# EasyEDA schematic SCH_BIKE-IOT-PCB-BY-AIM_2024-07-08.json
TITLE: charging station; REV: 1.0; Date: 2022-11-29; Sheet: 1/1; Drawn By: Humayun Siraj; Company: NCL-NEDUET
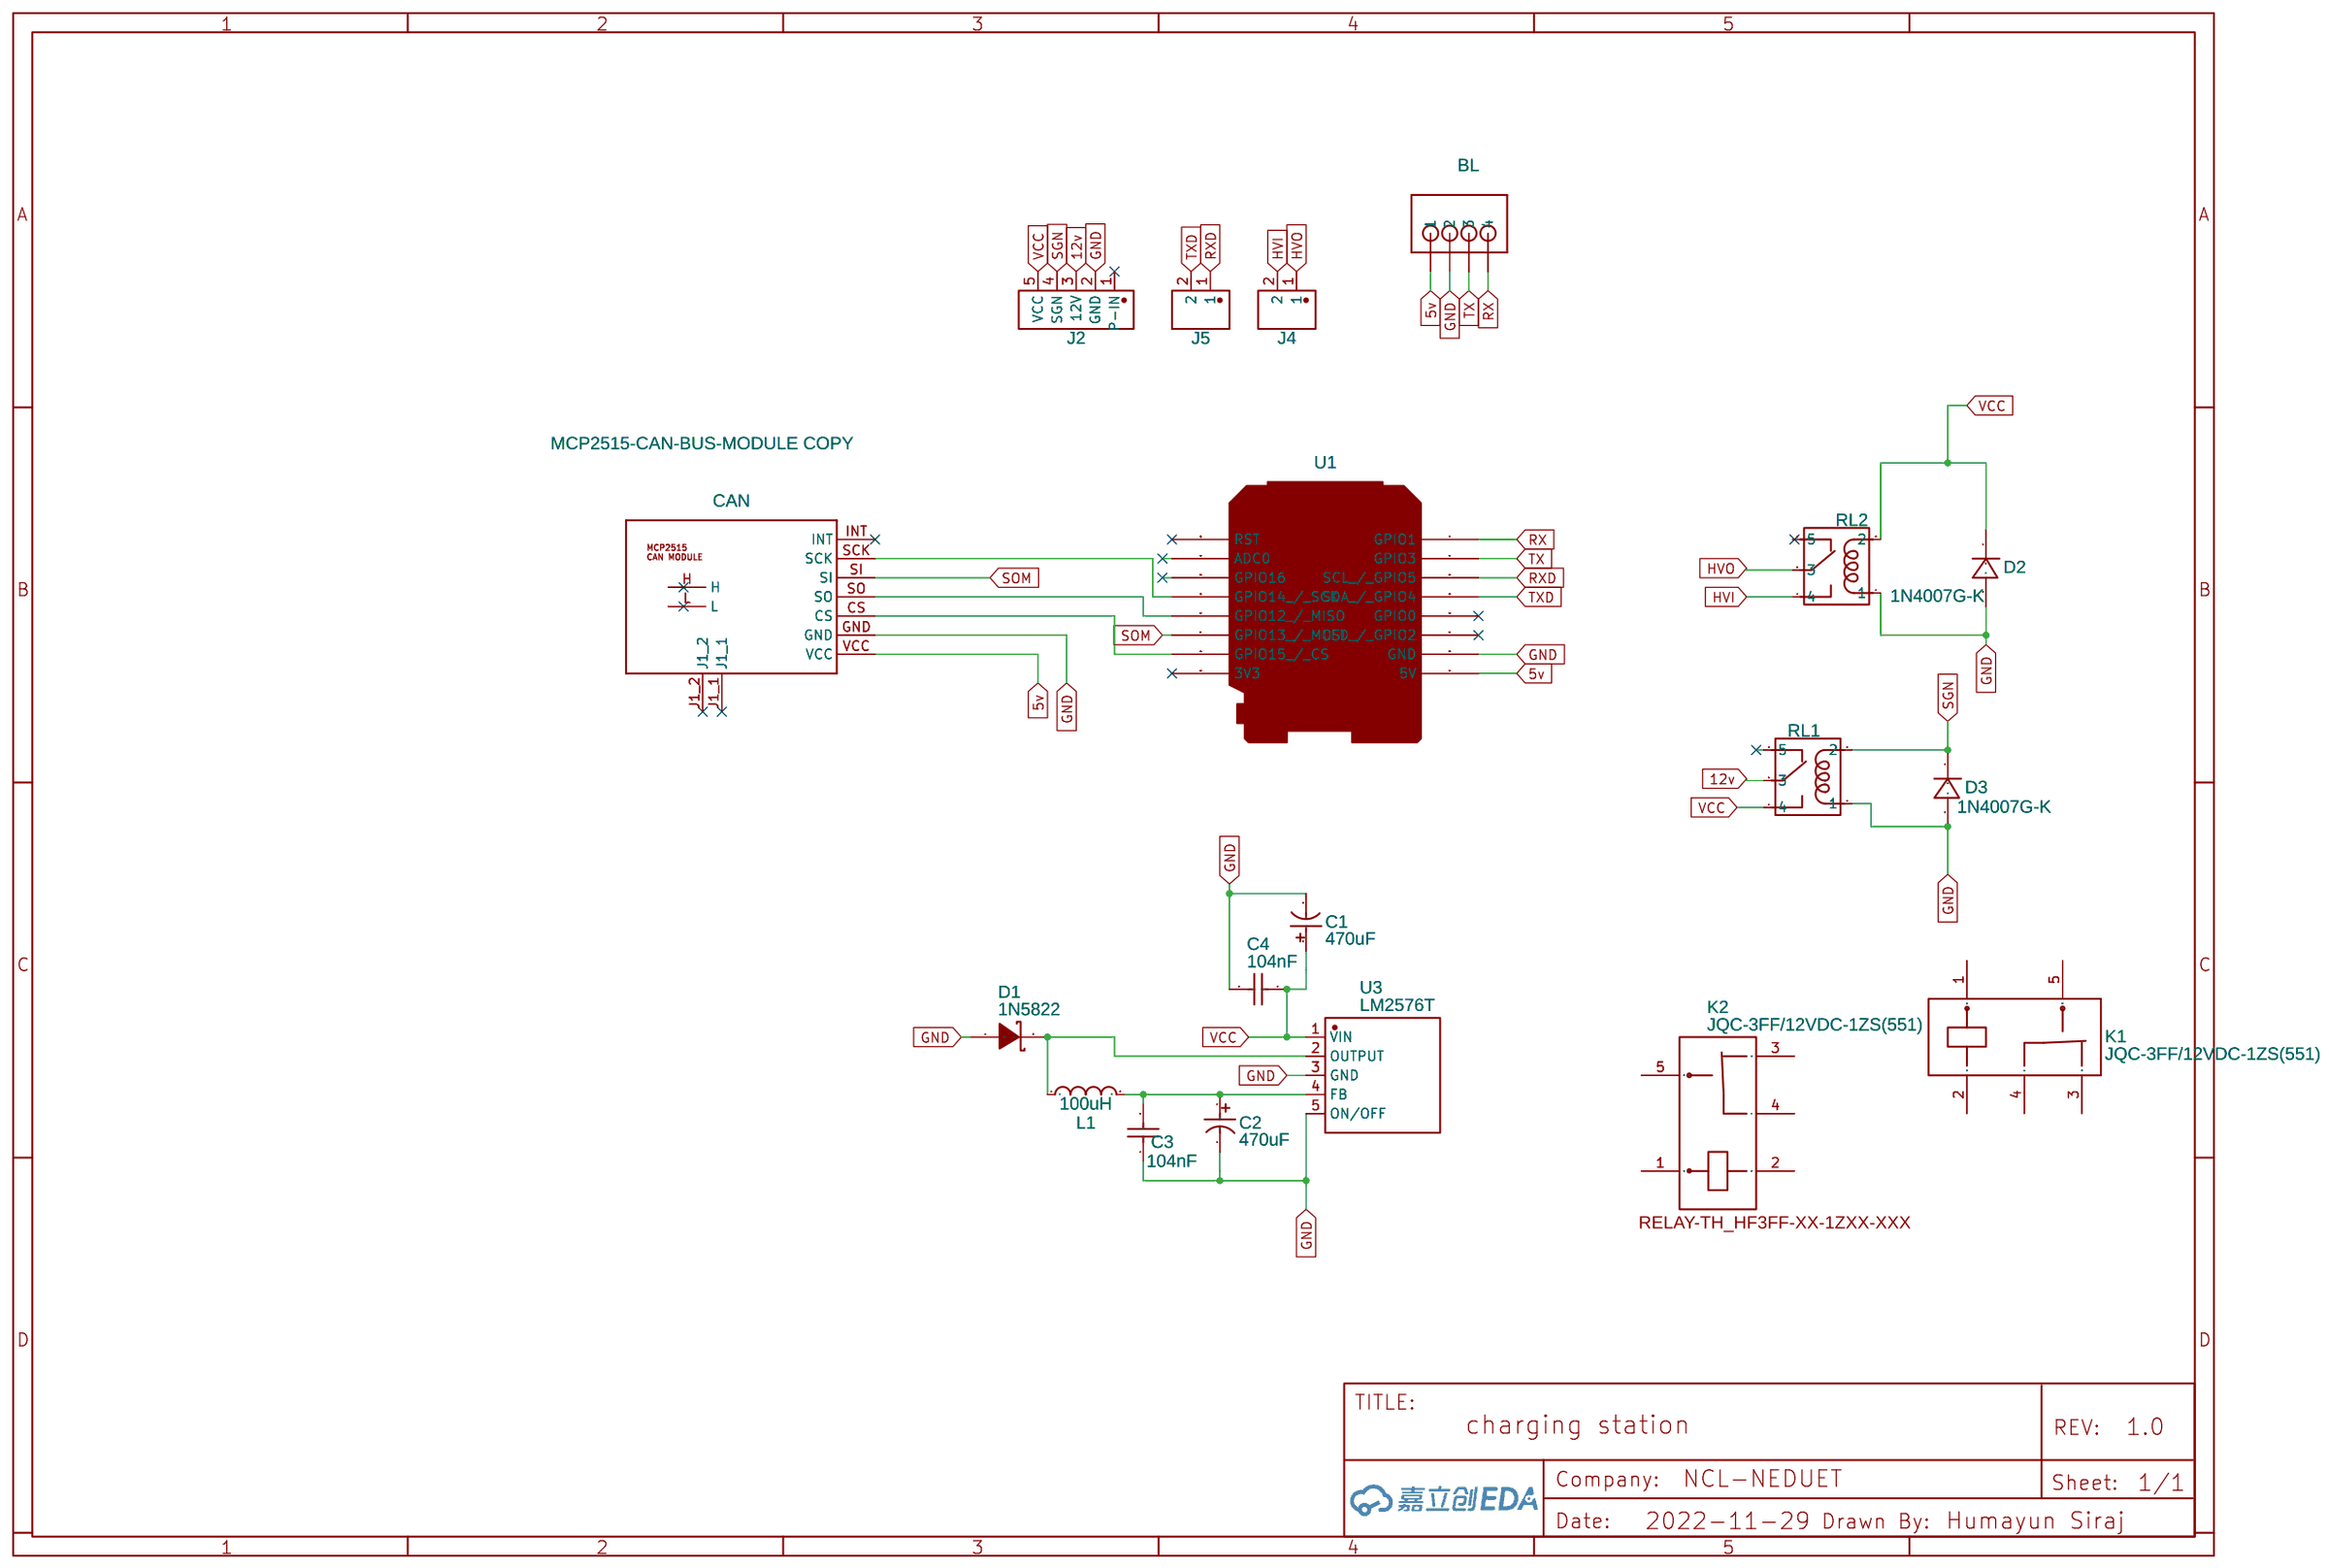
[diagram p0: schematic sheet]

## Parts
BL  JST-PH_4-PIN_HEADER  [JST_B4B-PH_HEADER]
C1  470uF  [CAP-TH_BD10.0-P5.00-D1.0-FD]
C2  470uF  [CAP-TH_BD10.0-P5.00-D1.0-FD]
C3  104nF  [CAP-TH_L7.2-W3.5-P5.00-D0.5]
C4  104nF  [CAP-TH_L7.2-W3.5-P5.00-D0.5]
CAN  MCP2515-CAN-BUS-MODULE COPY  [MCP2515-CAN-MODULE-ROP]
D1  1N5822  [DO-201AD_BD5.3-L8.4-P12.50-D1.4-FD]
D2  1N4007G-K  [DO-204AL_BD2.4-L4.7-P8.70-D1.1-RD]
D3  1N4007G-K  [DO-204AL_BD2.4-L4.7-P8.70-D1.1-RD]
J2  HT396V-3.96-5P  [CONN-TH_5P-P3.96_HT396V-3.96-5P]
J4  HT396V-3.96-2P_C577788  [CONN-TH_2P-P3.96_HT396V-3.96-2P]
J5  HT396V-3.96-2P_C577788  [CONN-TH_2P-P3.96_HT396V-3.96-2P]
K1  JQC-3FF/12VDC-1ZS(551)  [RELAY-TH_HF3FF-XX-1ZXX-XXX]
K2  JQC-3FF/12VDC-1ZS(551)  [RELAY-TH_HF3FF-XX-1ZXX-XXX]
L1  100uH  [IND-TH_BD12.0-P5.00-D0.9]
RL1  5 Pin Relay  [JQC-3FF]
RL2  5 Pin Relay  [JQC-3FF]
U1  ESP8266 D1 Mini  [ESP8266 D1 MINI]
U3  LM2576T  [LM2576T-012G]

## Library data of the parts
BL = JST-PH_4-PIN_HEADER
C1 C2 = ERS1HM471G20OT: Supplier: LCSC; Manufacturer: AISHI(艾华集团); Supplier Part: C106666; JLCPCB Part Class: Extended Part
C3 C4 = Calibration capacitor100nF（104）100V,5%: Supplier: LCSC; Manufacturer: ReliaPro; Supplier Part: C26609
CAN = MCP2515-CAN-BUS-MODULE COPY: Contributor: Kaupoi
D1 = 1N5822: Supplier: LCSC; Manufacturer: MDD(辰达半导体); Supplier Part: C2476; JLCPCB Part Class: Extended Part
D2 D3 = 1N4007G-K: Supplier: LCSC; Supplier Part: C410859; Manufacturer: Taiwan Semiconductor(台湾半导体); Contributor: LCSC; JLCPCB Part Class: Extended Part
J2 = HT396V-3.96-5P: Contributor: LCSC; Supplier: LCSC; Supplier Part: C577791; Manufacturer: KEFA(科发); JLCPCB Part Class: Extended Part
J4 J5 = HT396V-3.96-2P_C577788: Contributor: LCSC; Supplier: LCSC; Supplier Part: C577788; Manufacturer: KEFA(科发); Manufacturer Part: HT396V-3.96-2P; JLCPCB Part Class: Extended Part
K1 = JQC-3FF/12VDC-1ZS(551): Supplier: LCSC; Manufacturer: HF(宏发); Manufacturer Part: JQC-3FF/12VDC-1ZS（551); Supplier Part: C46485; JLCPCB Part Class: Extended Part
K2 = JQC-3FF/12VDC-1ZS(551): Supplier: LCSC; Manufacturer: HF(宏发); Manufacturer Part: JQC-3FF/12VDC-1ZS（551); Supplier Part: C46485; JLCPCB Part Class: Extended Part; Package Display: Yes
L1 = XR10*16-101K-L: Supplier: LCSC; Supplier Part: C7462868; Manufacturer: XR(祥如); Contributor: lcsc; JLCPCB Part Class: Extended Part
RL1 RL2 = 5 Pin Relay: Contributor: Bonr
U1 = ESP8266 D1 Mini: Contributor: Steh
U3 = LM2576T: Supplier: LCSC; Supplier Part: C398137; Manufacturer: Huaguan Semicon; Manufacturer Part: LM2576T-ADJ; Contributor: anleo

## Nets
5v: BL.P1(1) CAN.VCC U1.5V
12v: J2.3(12V) RL1.3
GND: BL.P2(2) C1.2 C2.2 C3.1 C4.1 CAN.GND D1.1(A) D2.2(A) D3.2(A) J2.2(GND) RL1.1 RL2.1 U1.GND U3.3(GND) U3.5(ON/OFF)
VCC: C1.1 C4.2 D2.1(C) J2.5(VCC) RL1.4 RL2.2 U3.1(VIN)
HVI: J4.2 RL2.4
HVO: J4.1 RL2.3
RX: BL.P4(4) U1.TX(GPIO1)
RXD: J5.1 U1.D1(SCL / GPIO5)
SGN: D3.1(C) J2.4(SGN) RL1.2
SOM: CAN.SI U1.D7(GPIO13 / MOSI)
TX: BL.P3(3) U1.RX(GPIO3)
TXD: J5.2 U1.D2(SDA / GPIO4)
Net-(C2-1): C2.1 C3.2 L1.2 U3.4(FB)
Net-(CAN-CS): CAN.CS U1.D8(GPIO15 / CS)
Net-(CAN-SCK): CAN.SCK U1.D5(GPIO14 / SCK)
Net-(CAN-SO): CAN.SO U1.D6(GPIO12 / MISO)
Net-(D1-2): D1.2(K) L1.1 U3.2(OUTPUT)

Not connected (* = marked no-connect by the designer): CAN H INT* J1_1* J1_2* L; J2 1(P-IN)*; K1 1 2 3 4 5; K2 1 2 3 4 5; RL1 5; RL2 5; U1 3V3* A0(ADC0) D0(GPIO16) D3(GPIO0)* D4(LED / GPIO2)* RST*
